# EAGLE schematic IRDetector (EAGLE 7.3.0)
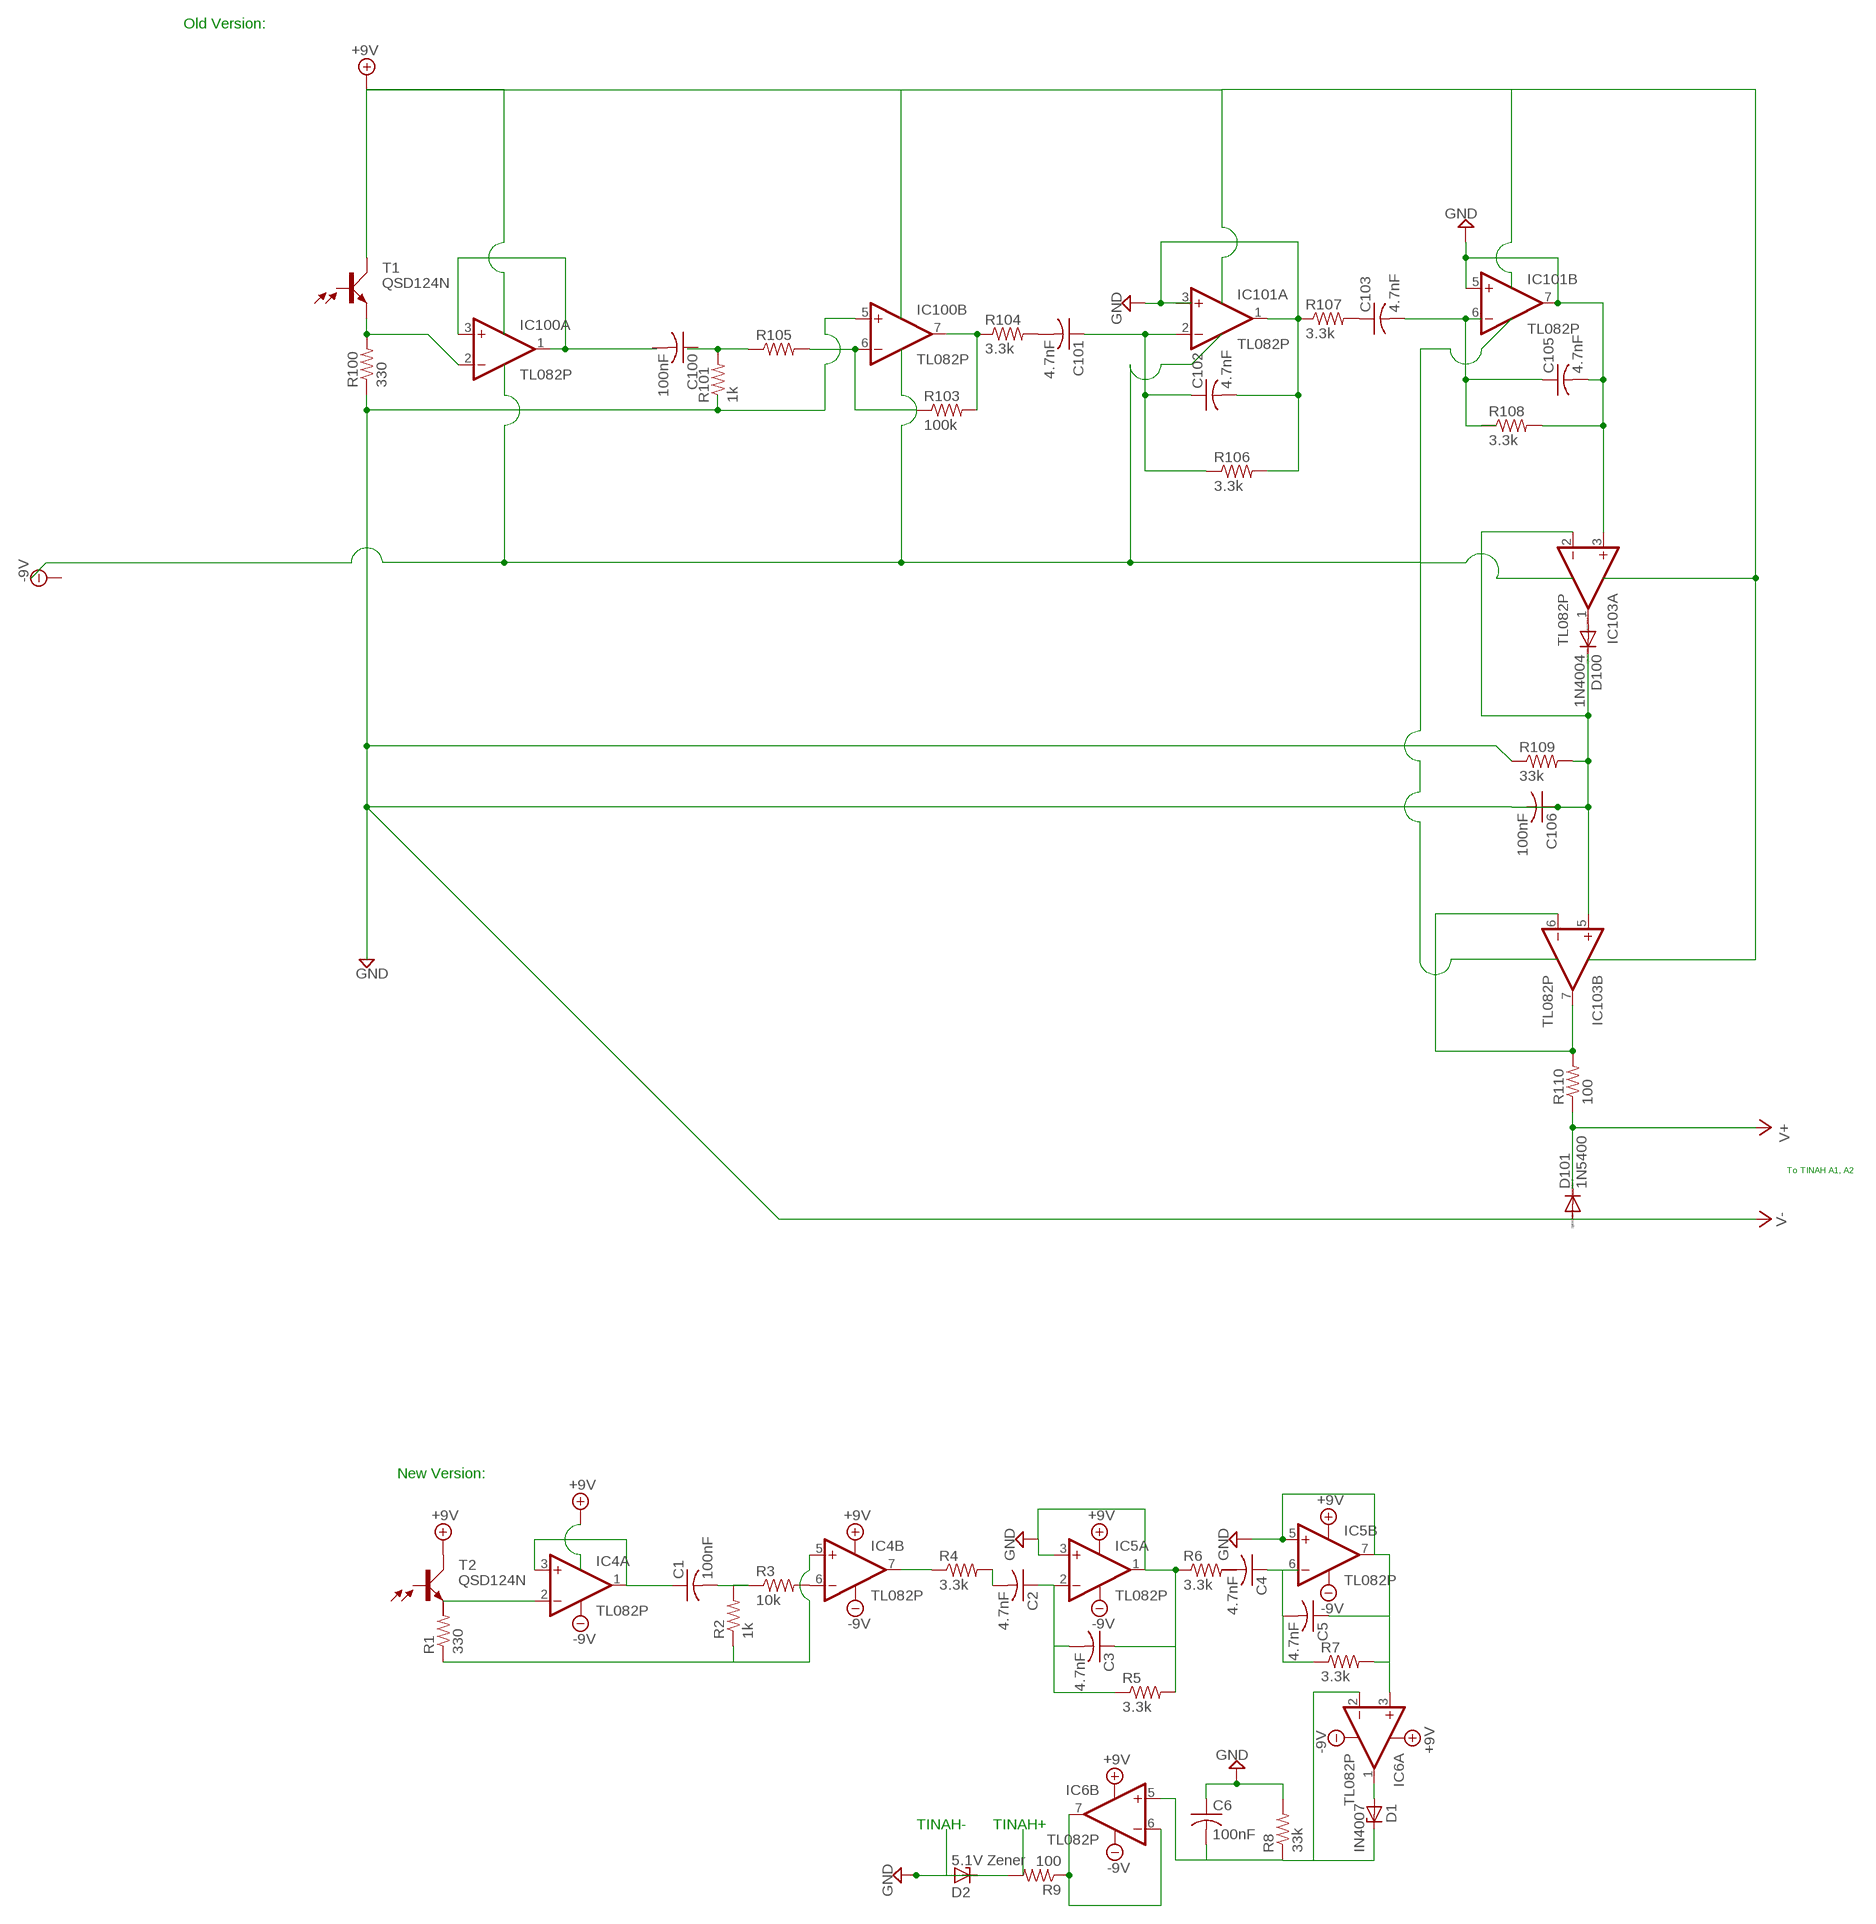
[diagram p0: schematic, sheet 1]

## Parts
C1  100nF  C-US025-024X044  [C025-024X044]
C2  4.7nF  C-US025-025X050  [C025-025X050]
C3  4.7nF  C-US025-025X050  [C025-025X050]
C4  4.7nF  C-US025-025X050  [C025-025X050]
C5  4.7nF  C-US025-025X050  [C025-025X050]
C6  100nF  C-US025-060X050  [C025-060X050]
C100  100nF  C-US025-024X044  [C025-024X044]
C101  4.7nF  C-US025-025X050  [C025-025X050]
C102  4.7nF  C-US050-055X075  [C050-055X075]
C103  4.7nF  C-US225-087X268  [C225-087X268]
C105  4.7nF  C-US050-045X075  [C050-045X075]
C106  100nF  C-US025-060X050  [C025-060X050]
D1  IN4007  ZENER-DIODEZD-5  [ZDIO-5]
D2  5.1V Zener  ZENER-DIODEZD-5  [ZDIO-5]
D100  1N4004  [DO41-10]
D101  1N5400  [DO201-15]
IC4  TL082P  [DIL08]
IC5  TL082P  [DIL08]
IC6  TL082P  [DIL08]
IC100  TL082P  [DIL08]
IC101  TL082P  [DIL08]
IC103  TL082P  [DIL08]
R1  330  R-US_0204/5  [0204/5]
R2  1k  R-US_0204/5  [0204/5]
R3  10k  R-US_0204/2V  [0204V]
R4  3.3k  R-US_01005  [R01005]
R5  3.3k  R-US_0207/5V  [0207/5V]
R6  3.3k  R-US_01005  [R01005]
R7  3.3k  R-US_0207/5V  [0207/5V]
R8  33k  R-US_0207/5V  [0207/5V]
R9  100  R-US_0414/5V  [0414V]
R100  330  R-US_0204/5  [0204/5]
R101  1k  R-US_0204/5  [0204/5]
R103  100k  R-US_01005  [R01005]
R104  3.3k  R-US_01005  [R01005]
R105  R-US_0207/5V  [0207/5V]
R106  3.3k  R-US_0207/5V  [0207/5V]
R107  3.3k  R-US_0207/5V  [0207/5V]
R108  3.3k  R-US_0309/12  [0309/12]
R109  33k  R-US_0207/5V  [0207/5V]
R110  100  R-US_0414/5V  [0414V]
T1  QSD124N  BP103  [BP103]
T2  QSD124N  BP103  [BP103]

## Nets
+9V: T2.C
+15V: T1.C ; supply symbol labelled +9V
GND: C3.1 C5.1 C6.1 C102.2 C105.2 D2.A D2.C IC5.1(A:OUT) IC5.3(A:+IN) IC5.5(B:+IN) IC5.7(B:OUT) IC6.3(A:+IN) IC101.1(A:OUT) IC101.5(B:+IN) IC101.7(B:OUT) IC103.3(A:+IN) R5.2 R6.1 R7.2 R8.2 R9.2 R106.2 R107.1 R108.2
N$1: IC100.2(A:-IN) R100.2 T1.E
N$2: IC100.1(A:OUT) IC100.3(A:+IN)
N$4: IC100.6(B:-IN) R103.1 R105.2
N$5: IC100.7(B:OUT) R103.2 R104.1
N$6: R101.2 R105.1
N$7: C101.1 C102.1 IC101.2(A:-IN) R106.1
N$8: C101.2 R104.2
N$9: D100.A IC103.1(A:OUT)
N$10: IC4.2(A:-IN) R1.2
N$11: C1.1 IC4.1(A:OUT) IC4.3(A:+IN)
N$12: IC103.6(B:-IN) IC103.7(B:OUT) R110.2
N$13: C103.1 R107.2
N$14: C103.2 C105.1 IC101.6(B:-IN) R108.1
N$16: IC4.7(B:OUT) R4.1
N$17: C1.2 R2.2 R3.1
N$18: IC4.6(B:-IN) R3.2
N$19: IC4.5(B:+IN) R1.1 R2.1
N$20: C2.1 C3.2 IC5.2(A:-IN) R5.1
N$21: C2.2 R4.2
N$22: C4.1 C5.2 R7.1
N$23: D1.A IC6.1(A:OUT)
N$24: C6.2 D1.C IC6.2(A:-IN) IC6.5(B:+IN) R8.1
N$25: IC6.6(B:-IN) IC6.7(B:OUT) R9.1
V+: D101.C R110.1
V-: C106.1 C106.2 D100.C D101.A IC100.5(B:+IN) IC103.2(A:-IN) IC103.5(B:+IN) R100.1 R101.1 R109.1 R109.2
Unconnected: C4.2 C100.1 C100.2 IC5.6(B:-IN) IC101.3(A:+IN) R6.2 T1.B T2.B T2.E

## Notes on the sheet
- Old Version:
- To TINAH A1, A2
- New Version:
- TINAH- | TINAH+

## Power pins joined to a net without a drawn wire
V+: IC4.8(P:V+) IC5.8(P:V+) IC6.8(P:V+) IC100.8(P:V+) IC101.8(P:V+) IC103.8(P:V+)
V-: IC4.4(P:V-) IC5.4(P:V-) IC6.4(P:V-) IC100.4(P:V-) IC101.4(P:V-) IC103.4(P:V-)

## Library data of the parts
C1-C6 C100-C103 C105 C106 = resistor:C-US: CAPACITOR, American symbol
D1 D2 = diode:ZENER-DIODE: Z-Diode
D100 = diode:1N4004: DIODE general purpose rectifier, 1 A
D101 = diode:1N5400: DIODE standard rectifier, 3 A, 50 V (Motorola)
IC4-IC6 IC100 IC101 IC103 = linear:TL082: OP AMP Data sheet <http://www.ti.com/lit/ds/symlink/tl084a . pdf>; DATA_SHEET: <a href="http://www.ti.com/lit/ds/symlink/tl084a.pdf"> Data sheet </a>
R1-R9 R100 R101 R103-R110 = resistor:R-US_: RESISTOR, American symbol
T1 T2 = opto-trans-siemens:BP103: PHOTO TRANSISTOR; OC_FARNELL: unknown; OC_NEWARK: unknown